# Altium schematic sheet MultiChannel_ADC.SchDoc
size A4
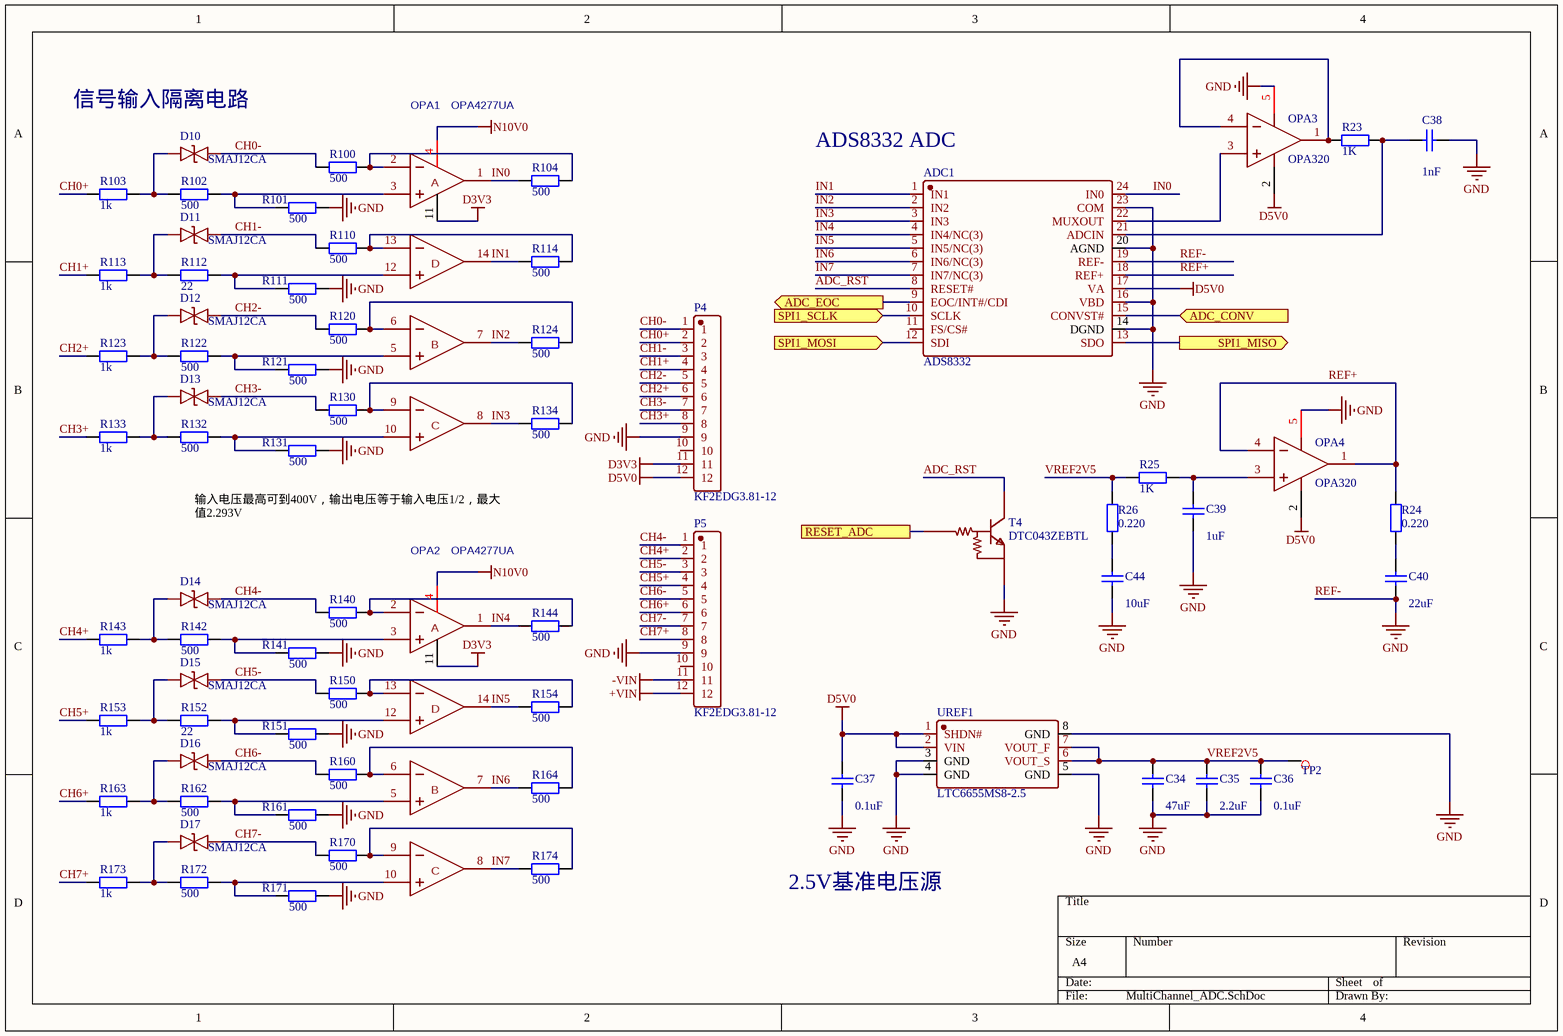
[diagram p0: MultiChannel_ADC.SchDoc]

## Parts
ADC1  ADS8332  [TSSOP-24_L7.8-W4.4-P0.65-LS6.4-BL]
C34  value 47uF  [C1206]
C35  value 2.2uF  [C1206]
C36  value 0.1uF  [C1206]
C37  value 0.1uF  [C1206]
C38  value 1nF  [C1206]
C39  value 1uF  [C1206]
C40  value 22uF  [C1206]
C44  value 10uF  [C1206]
D10  SMAJ12CA  [SMB_L4.6-W3.6-LS5.3-BI]
D11  SMAJ12CA  [SMB_L4.6-W3.6-LS5.3-BI]
D12  SMAJ12CA  [SMB_L4.6-W3.6-LS5.3-BI]
D13  SMAJ12CA  [SMB_L4.6-W3.6-LS5.3-BI]
D14  SMAJ12CA  [SMB_L4.6-W3.6-LS5.3-BI]
D15  SMAJ12CA  [SMB_L4.6-W3.6-LS5.3-BI]
D16  SMAJ12CA  [SMB_L4.6-W3.6-LS5.3-BI]
D17  SMAJ12CA  [SMB_L4.6-W3.6-LS5.3-BI]
OPA1  OPA4277UA  [SOP-14_L8.6-W3.9-P1.27-LS6.0-BL]
OPA2  OPA4277UA  [SOP-14_L8.6-W3.9-P1.27-LS6.0-BL]
OPA3  OPA320  [SOT-23-5_L3.0-W1.7-P0.95-LS2.8-BR]
OPA4  OPA320  [SOT-23-5_L3.0-W1.7-P0.95-LS2.8-BR]
P4  KF2EDG3.81-12  [CONN-TH_12P-P3.81_KF2EDGV-3.81-12P]
P5  KF2EDG3.81-12  [CONN-TH_12P-P3.81_KF2EDGV-3.81-12P]
R23  1K  [0805_R]
R24  0.220  [0805_R]
R25  1K  [0805_R]
R26  0.220  [0805_R]
R100  500  [0805_R]
R101  500  [0805_R]
R102  500  [0805_R]
R103  1k  [0805_R]
R104  500  [0805_R]
R110  500  [0805_R]
R111  500  [0805_R]
R112  22  [0805_R]
R113  1k  [0805_R]
R114  500  [0805_R]
R120  500  [0805_R]
R121  500  [0805_R]
R122  500  [0805_R]
R123  1k  [0805_R]
R124  500  [0805_R]
R130  500  [0805_R]
R131  500  [0805_R]
R132  500  [0805_R]
R133  1k  [0805_R]
R134  500  [0805_R]
R140  500  [0805_R]
R141  500  [0805_R]
R142  500  [0805_R]
R143  1k  [0805_R]
R144  500  [0805_R]
R150  500  [0805_R]
R151  500  [0805_R]
R152  22  [0805_R]
R153  1k  [0805_R]
R154  500  [0805_R]
R160  500  [0805_R]
R161  500  [0805_R]
R162  500  [0805_R]
R163  1k  [0805_R]
R164  500  [0805_R]
R170  500  [0805_R]
R171  500  [0805_R]
R172  500  [0805_R]
R173  1k  [0805_R]
R174  500  [0805_R]
T4  DTC043ZEBTL  [SOT-416_L1.6-W0.8-P1.00-LS1.6-BR]
TP2  Test-Point  [TP]  (value not drawn)
UREF1  LTC6655MS8-2.5  [MSOP-8_L3.0-W3.0-P0.65-LS4.9-BL]

## Ports
ADC_CONV (in), ADC_EOC (out), RESET_ADC, SPI1_MISO (out), SPI1_MOSI (in), SPI1_SCLK (in)

## Nets
+VIN: P5.12
-VIN: P5.11
D3V3: OPA1.11(V-) OPA2.11(V-) P4.11
D5V0: ADC1.17(VA) C37.1 OPA3.2(V-) OPA4.2(V-) P4.12 UREF1.1(SHDN#) UREF1.2(VIN)
N10V0: OPA1.4(V+) OPA2.4(V+)
REF-: ADC1.14(DGND) ADC1.16(VBD) ADC1.19(REF-) ADC1.20(AGND) ADC1.23(COM) C34.2 C35.2 C36.2 C37.2 C38.2 C39.1 C40.1 C44.1 OPA3.5(V+) OPA4.5(V+) P4.9 P5.9 R101.1 R111.1 R121.1 R131.1 R141.1 R151.1 R161.1 R171.1 T4.2(E) UREF1.3(GND) UREF1.4(GND) UREF1.5(GND) UREF1.8(GND)  [also labelled GND]
ADC_CONV: ADC1.15(CONVST#) ; port ADC_CONV
ADC_EOC: ADC1.9(EOC/INT#/CDI) ; port ADC_EOC
ADC_RST: ADC1.8(RESET#) T4.3(C)
CH0+: P4.2 R103.2
CH0-: D10.1 P4.1 R100.2
CH1+: P4.4 R113.2
CH1-: D11.1 P4.3 R110.2
CH2+: P4.6 R123.2
CH2-: D12.1 P4.5 R120.2
CH3+: P4.8 R133.2
CH3-: D13.1 P4.7 R130.2
CH4+: P5.2 R143.2
CH4-: D14.1 P5.1 R140.2
CH5+: P5.4 R153.2
CH5-: D15.1 P5.3 R150.2
CH6+: P5.6 R163.2
CH6-: D16.1 P5.5 R160.2
CH7+: P5.8 R173.2
CH7-: D17.1 P5.7 R170.2
IN0: ADC1.24(IN0) OPA1.1(OUT_A) R104.2
IN1: ADC1.1(IN1) OPA1.14(OUT_D) R114.2
IN2: ADC1.2(IN2) OPA1.7(OUT_B) R124.2
IN3: ADC1.3(IN3) OPA1.8(OUT_C) R134.2
IN4: ADC1.4(IN4/NC(3)) OPA2.1(OUT_A) R144.2
IN5: ADC1.5(IN5/NC(3)) OPA2.14(OUT_D) R154.2
IN6: ADC1.6(IN6/NC(3)) OPA2.7(OUT_B) R164.2
IN7: ADC1.7(IN7/NC(3)) OPA2.8(OUT_C) R174.2
REF+: ADC1.18(REF+) OPA4.1(OUT) OPA4.4(IN-) R24.1
RESET_ADC: T4.1(B) ; port RESET_ADC
SPI1_MISO: ADC1.13(SDO) ; port SPI1_MISO
SPI1_MOSI: ADC1.12(SDI) ; port SPI1_MOSI
SPI1_SCLK: ADC1.10(SCLK) ; port SPI1_SCLK
VREF2V5: C34.1 C35.1 C36.1 R25.2 R26.1 TP2.1 UREF1.6(VOUT_S) UREF1.7(VOUT_F)
NetADC1_21: ADC1.21(ADCIN) C38.1 R23.1
NetADC1_22: ADC1.22(MUXOUT) OPA3.3(IN+)
NetC39_2: C39.2 OPA4.3(IN+) R25.1
NetC40_2: C40.2 R24.2
NetC44_2: C44.2 R26.2
NetD10_2: D10.2 R102.2 R103.1
NetD11_2: D11.2 R112.2 R113.1
NetD12_2: D12.2 R122.2 R123.1
NetD13_2: D13.2 R132.2 R133.1
NetD14_2: D14.2 R142.2 R143.1
NetD15_2: D15.2 R152.2 R153.1
NetD16_2: D16.2 R162.2 R163.1
NetD17_2: D17.2 R172.2 R173.1
NetOPA1_2: OPA1.2(-IN_A) R100.1 R104.1
NetOPA1_3: OPA1.3(+IN_A) R101.2 R102.1
NetOPA1_5: OPA1.5(+IN_B) R121.2 R122.1
NetOPA1_6: OPA1.6(-IN_B) R120.1 R124.1
NetOPA1_9: OPA1.9(-IN_C) R130.1 R134.1
NetOPA1_10: OPA1.10(+IN_C) R131.2 R132.1
NetOPA1_12: OPA1.12(+IN_D) R111.2 R112.1
NetOPA1_13: OPA1.13(-IN_D) R110.1 R114.1
NetOPA2_2: OPA2.2(-IN_A) R140.1 R144.1
NetOPA2_3: OPA2.3(+IN_A) R141.2 R142.1
NetOPA2_5: OPA2.5(+IN_B) R161.2 R162.1
NetOPA2_6: OPA2.6(-IN_B) R160.1 R164.1
NetOPA2_9: OPA2.9(-IN_C) R170.1 R174.1
NetOPA2_10: OPA2.10(+IN_C) R171.2 R172.1
NetOPA2_12: OPA2.12(+IN_D) R151.2 R152.1
NetOPA2_13: OPA2.13(-IN_D) R150.1 R154.1
NetOPA3_1: OPA3.1(OUT) OPA3.4(IN-) R23.2

Not connected (* = marked no-connect by the designer): ADC1 11(FS/CS#); P4 10; P5 10

## Notes on the sheet
- (near D10) 信号输入隔离电路
- (near ADC1) ADS8332 ADC
- 输入电压最高可到400V，输出电压等于输入电压1/2，最大值2.293V
- 2.5V基准电压源
- (in symbol OPA4277UA) A; D; B; C

## Library data of the parts
C34-C40 C44 = Cap Semi: Capacitor (Semiconductor SIM Model); Published: 8-Jun-2000; LatestRevisionDate: 29-May-2009; LatestRevisionNote: IPC-7351 Footprint Added.; PackageReference: C1206; Publisher: Altium Limited; PackageDescription: Chip Capacitor
D10-D17 = SMBJ-XXCA
OPA1 OPA2 = OPA4277UA: BOM_Manufacturer: TI; subpart_no: 4; SMT Type: Extend; spicePre: X; BOM_Supplier: LCSC; BOM_Manufacturer Part: OPA4277UA; image: //image.lceda.cn/szlcsc/C51504.jpg; BOM_Supplier Part: C51504; BOM_LCSC Assembly: Yes; spiceSymbolName: OPA4277UA
R23-R26 R100-R104 R110-R114 R120-R124 R130-R134 R140-R144 R150-R154 R160-R164 R170-R174 = Res_0805: 0805贴片电阻; ComponentLink1Description: 供应商链接; ComponentLink1URL: http://www.szlcsc.com/product/details_26856.html; Package: 0805; Supplier: LC; SuppliersPartNumber: C26113
UREF1 = LTC6655MS8-5